# EasyEDA Pro project keyboard.epro

# Schematic sch
Board Name: keyboard; Create Date: 2025-10-21; Page Name: sch-1; Project Name: grabert; Schematic Name: sch; Update Date: 2026-06-16; File: grabert; Id: /; Sheet: /
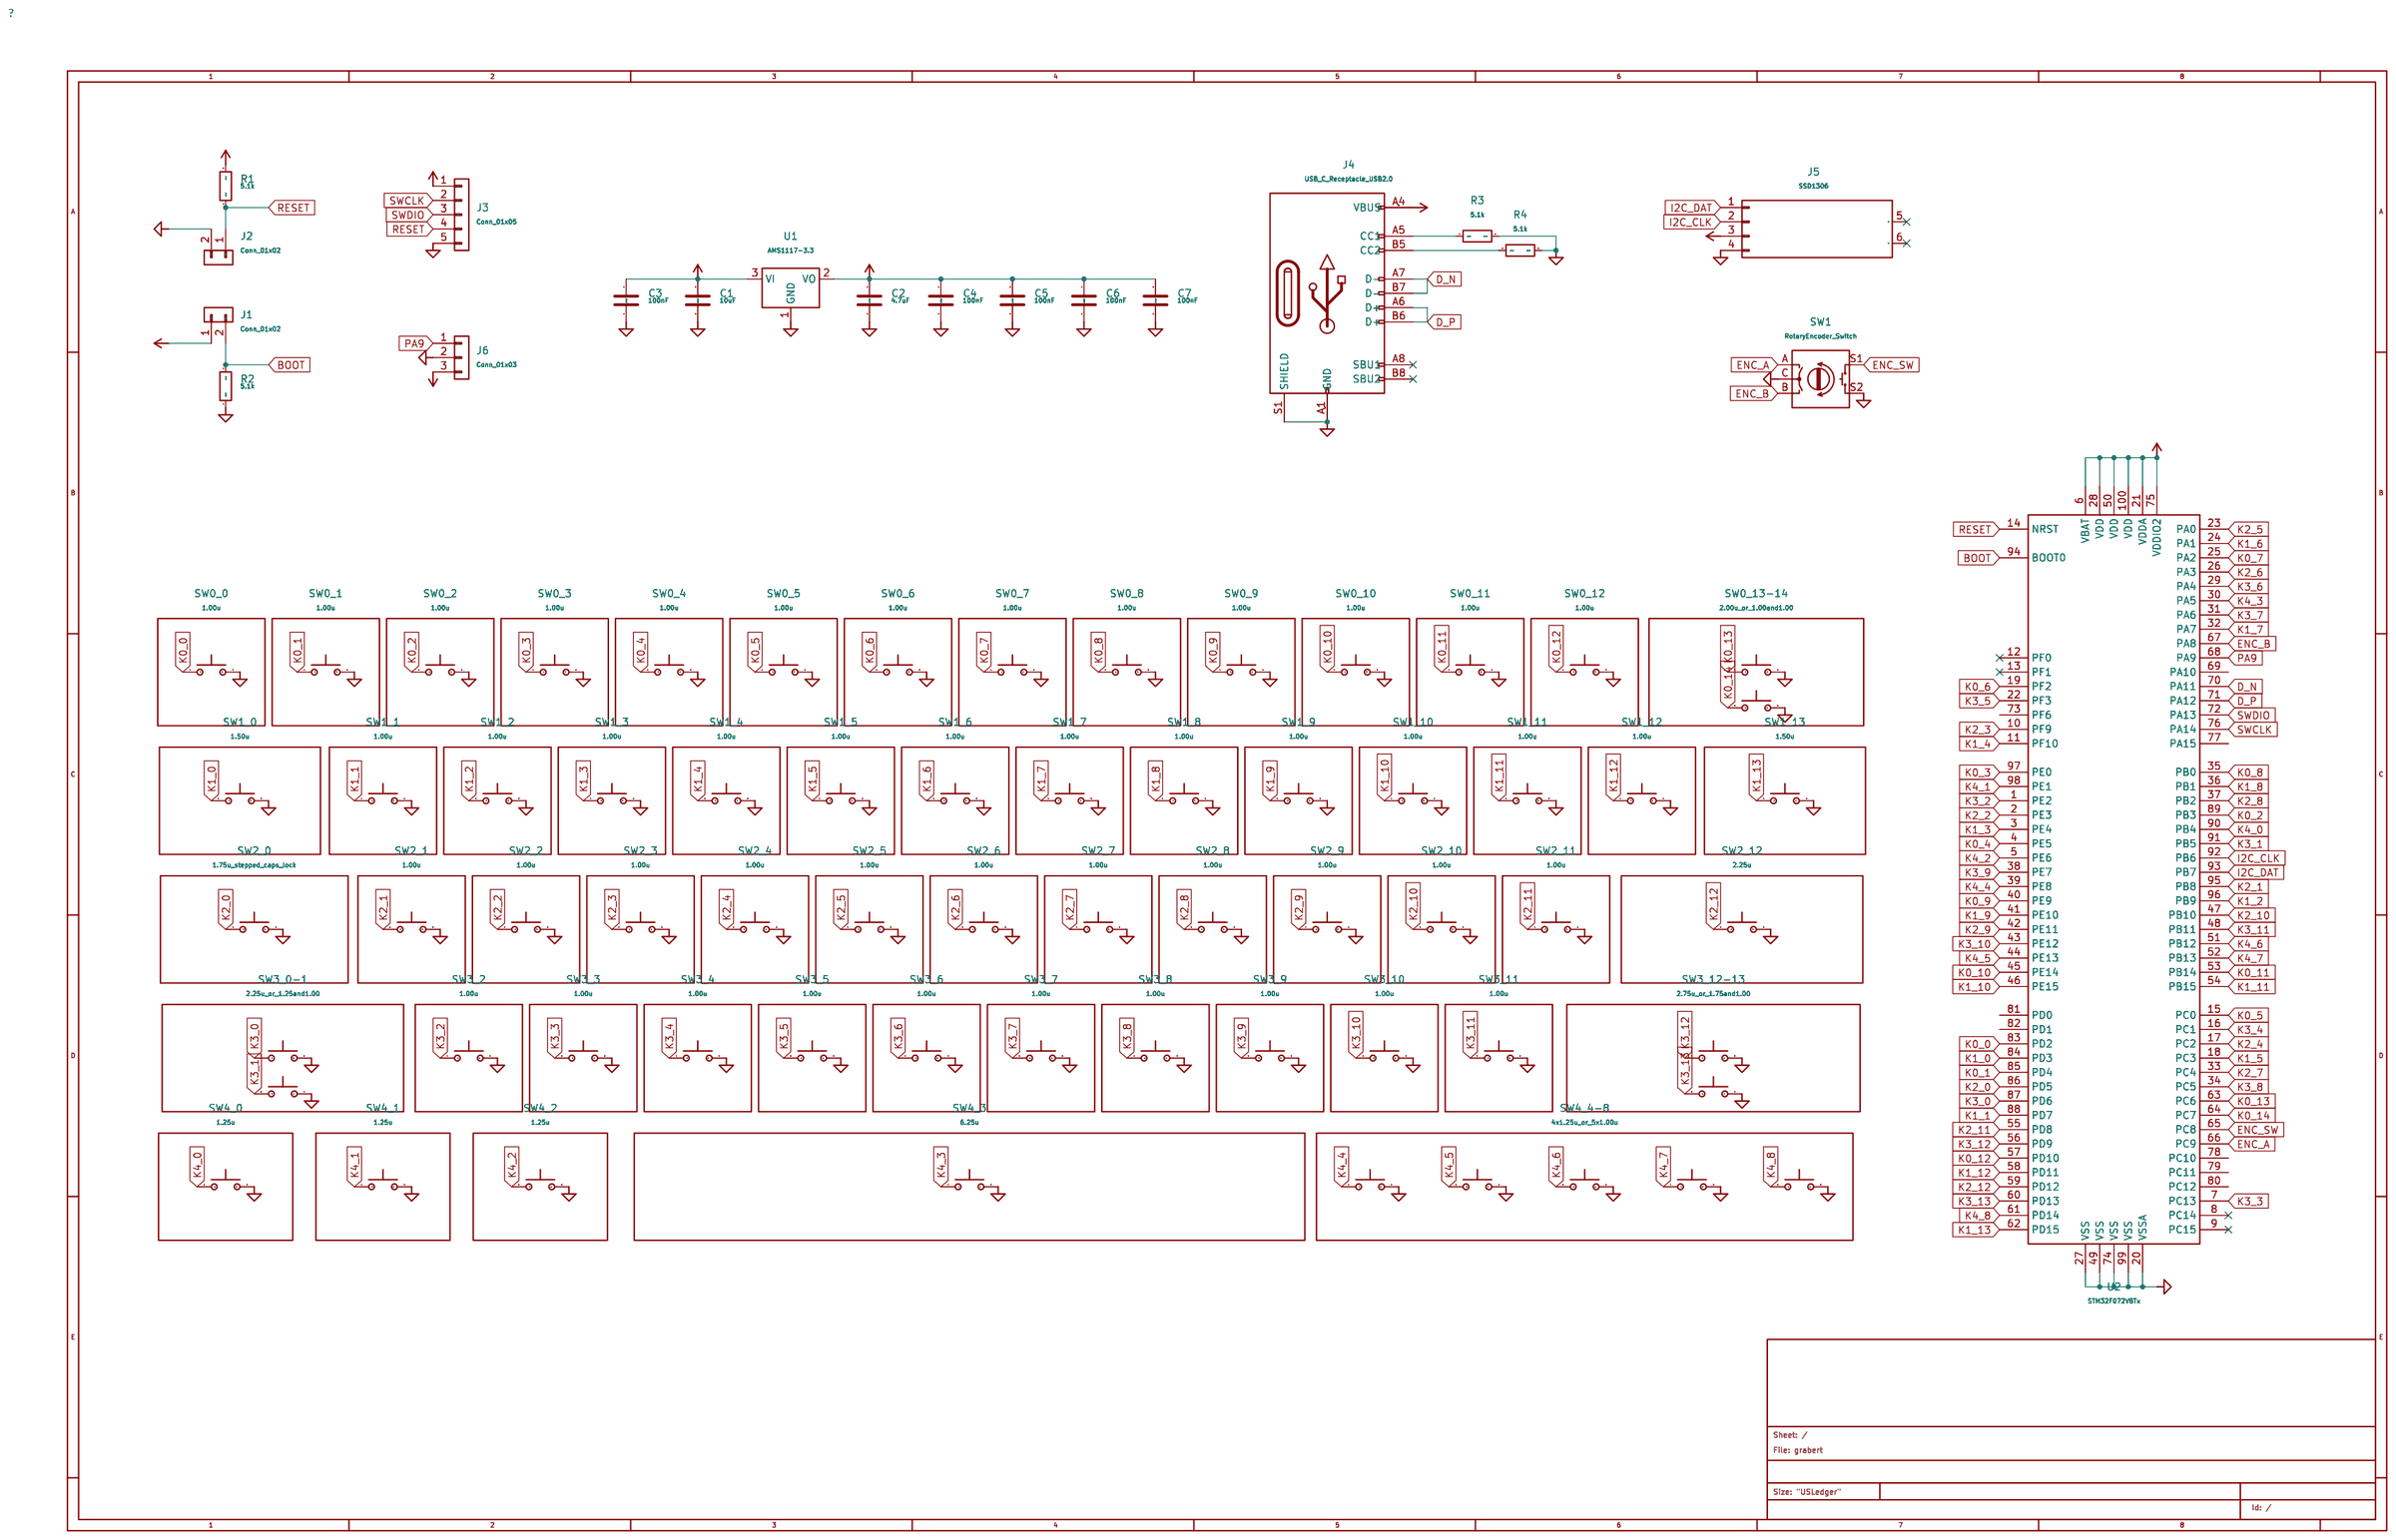
[diagram p0: schematic sheet]

## Parts
C1  10uF
C2  4.7uF
C3  100nF
C4  100nF
C5  100nF
C6  100nF
C7  100nF
J1  Conn_01x02
J2  Conn_01x02
J3  Conn_01x05
J4  USB_C_Receptacle_USB2.0
J5  SSD1306
J6  Conn_01x03
R1  5.1k
R2  5.1k
R3  5.1k
R4  5.1k
SW0_0  1.00u
SW0_1  1.00u
SW0_2  1.00u
SW0_3  1.00u
SW0_4  1.00u
SW0_5  1.00u
SW0_6  1.00u
SW0_7  1.00u
SW0_8  1.00u
SW0_9  1.00u
SW0_10  1.00u
SW0_11  1.00u
SW0_12  1.00u
SW0_13-14  2.00u_or_1.00and1.00
SW1  RotaryEncoder_Switch
SW1_0  1.50u
SW1_1  1.00u
SW1_2  1.00u
SW1_3  1.00u
SW1_4  1.00u
SW1_5  1.00u
SW1_6  1.00u
SW1_7  1.00u
SW1_8  1.00u
SW1_9  1.00u
SW1_10  1.00u
SW1_11  1.00u
SW1_12  1.00u
SW1_13  1.50u
SW2_0  1.75u_stepped_caps_lock
SW2_1  1.00u
SW2_2  1.00u
SW2_3  1.00u
SW2_4  1.00u
SW2_5  1.00u
SW2_6  1.00u
SW2_7  1.00u
SW2_8  1.00u
SW2_9  1.00u
SW2_10  1.00u
SW2_11  1.00u
SW2_12  2.25u
SW3_0-1  2.25u_or_1.25and1.00
SW3_2  1.00u
SW3_3  1.00u
SW3_4  1.00u
SW3_5  1.00u
SW3_6  1.00u
SW3_7  1.00u
SW3_8  1.00u
SW3_9  1.00u
SW3_10  1.00u
SW3_11  1.00u
SW3_12-13  2.75u_or_1.75and1.00
SW4_0  1.25u
SW4_1  1.25u
SW4_2  1.25u
SW4_3  6.25u
SW4_4-8  4x1.25u_or_5x1.00u
U1  AMS1117-3.3
U2  STM32F072V8Tx

## Library data of the parts
C1-C7 = Device_C
J1 J2 = Connector_Generic_Conn_01x02
J3 = Connector_Generic_Conn_01x05
J4 = Connector_USB_C_Receptacle_USB2.0: User doc link: https://www.usb.org/sites/default/files/documents/usb_type-c.zip
J5 = kobuss_SSD1306
J6 = Connector_Generic_Conn_01x03
R1-R4 = Device_R
SW0_0-SW0_12 SW1_1-SW1_12 SW2_1-SW2_11 SW3_2-SW3_11 = kobuss_1.00u
SW0_13-14 = kobuss_2.00u_or_1.00and1.00
SW1 = Device_RotaryEncoder_Switch
SW1_0 SW1_13 = kobuss_1.50u
SW2_0 = kobuss_1.75u_stepped_caps_lock
SW2_12 = kobuss_2.25u
SW3_0-1 = kobuss_2.25u_or_1.25and1.00
SW3_12-13 = kobuss_2.75u_or_1.75and1.00
SW4_0-SW4_2 = kobuss_1.25u
SW4_3 = kobuss_6.25u
SW4_4-8 = kobuss_4x1.25u_or_5x1.00u
U1 = Regulator_Linear_AMS1117-3.3: User doc link: http://www.advanced-monolithic.com/pdf/ds1117.pdf
U2 = MCU_ST_STM32F0_STM32F072V8Tx: User doc link: http://www.st.com/st-web-ui/static/active/en/resource/technical/document/datasheet/DM00090510.pdf

## Nets
BOOT: J1.2(Pin) R2.2 U2.94(BOOT0)
D_N: J4.A7(D-) J4.B7(D-) U2.70(PA11)
D_P: J4.A6(D+) J4.B6(D+) U2.71(PA12)
ENC_A: SW1.A U2.66(PC9)
ENC_B: SW1.B U2.67(PA8)
ENC_SW: SW1.S1 U2.65(PC8)
I2C_CLK: J5.2(SCL) U2.92(PB6)
I2C_DAT: J5.1(SDA) U2.93(PB7)
K0_0: SW0_0.1 U2.83(PD2)
K0_1: SW0_1.1 U2.85(PD4)
K0_2: SW0_2.1 U2.89(PB3)
K0_3: SW0_3.1 U2.97(PE0)
K0_4: SW0_4.1 U2.4(PE5)
K0_5: SW0_5.1 U2.15(PC0)
K0_6: SW0_6.1 U2.19(PF2)
K0_7: SW0_7.1 U2.25(PA2)
K0_8: SW0_8.1 U2.35(PB0)
K0_9: SW0_9.1 U2.40(PE9)
K0_10: SW0_10.1 U2.45(PE14)
K0_11: SW0_11.1 U2.53(PB14)
K0_12: SW0_12.1 U2.57(PD10)
K0_13: SW0_13-14.1 U2.63(PC6)
K0_14: SW0_13-14.3 U2.64(PC7)
K1_0: SW1_0.1 U2.84(PD3)
K1_1: SW1_1.1 U2.88(PD7)
K1_2: SW1_2.1 U2.96(PB9)
K1_3: SW1_3.1 U2.3(PE4)
K1_4: SW1_4.1 U2.11(PF10)
K1_5: SW1_5.1 U2.18(PC3)
K1_6: SW1_6.1 U2.24(PA1)
K1_7: SW1_7.1 U2.32(PA7)
K1_8: SW1_8.1 U2.36(PB1)
K1_9: SW1_9.1 U2.41(PE10)
K1_10: SW1_10.1 U2.46(PE15)
K1_11: SW1_11.1 U2.54(PB15)
K1_12: SW1_12.1 U2.58(PD11)
K1_13: SW1_13.1 U2.62(PD15)
K2_0: SW2_0.1 U2.86(PD5)
K2_1: SW2_1.1 U2.95(PB8)
K2_2: SW2_2.1 U2.2(PE3)
K2_3: SW2_3.1 U2.10(PF9)
K2_4: SW2_4.1 U2.17(PC2)
K2_5: SW2_5.1 U2.23(PA0)
K2_6: SW2_6.1 U2.26(PA3)
K2_7: SW2_7.1 U2.33(PC4)
K2_8: SW2_8.1 U2.37(PB2)
K2_9: SW2_9.1 U2.42(PE11)
K2_10: SW2_10.1 U2.47(PB10)
K2_11: SW2_11.1 U2.55(PD8)
K2_12: SW2_12.1 U2.59(PD12)
K3_0: SW3_0-1.1 U2.87(PD6)
K3_1: SW3_0-1.3 U2.91(PB5)
K3_2: SW3_2.1 U2.1(PE2)
K3_3: SW3_3.1 U2.7(PC13)
K3_4: SW3_4.1 U2.16(PC1)
K3_5: SW3_5.1 U2.22(PF3)
K3_6: SW3_6.1 U2.29(PA4)
K3_7: SW3_7.1 U2.31(PA6)
K3_8: SW3_8.1 U2.34(PC5)
K3_9: SW3_9.1 U2.38(PE7)
K3_10: SW3_10.1 U2.43(PE12)
K3_11: SW3_11.1 U2.48(PB11)
K3_12: SW3_12-13.1 U2.56(PD9)
K3_13: SW3_12-13.3 U2.60(PD13)
K4_0: SW4_0.1 U2.90(PB4)
K4_1: SW4_1.1 U2.98(PE1)
K4_2: SW4_2.1 U2.5(PE6)
K4_3: SW4_3.1 U2.30(PA5)
K4_4: SW4_4-8.1 U2.39(PE8)
K4_5: SW4_4-8.3 U2.44(PE13)
K4_6: SW4_4-8.5 U2.51(PB12)
K4_7: SW4_4-8.7 U2.52(PB13)
K4_8: SW4_4-8.9 U2.61(PD14)
PA9: J6.1(Pin) U2.68(PA9)
POWER_+3V3: C2.1 C4.1 C5.1 C6.1 C7.1 J1.1(Pin) J3.1(Pin) J5.3(VCC) R1.2 U1.2(VO) U2.6(VBAT) U2.21(VDDA) U2.28(VDD) U2.50(VDD) U2.75(VDDIO2) U2.100(VDD)
POWER_+5V: C1.1 C3.1 J4.A4(VBUS) J4.A9(VBUS) J4.B4(VBUS) J4.B9(VBUS) J6.3(Pin) U1.3(VI)
POWER_GND: C1.2 C2.2 C3.2 C4.2 C5.2 C6.2 C7.2 J2.2(Pin) J3.5(Pin) J4.A1(GND) J4.A12(GND) J4.B1(GND) J4.B12(GND) J4.S1(SHIELD) J5.4(GND) J6.2(Pin) R2.1 R3.2 R4.2 SW0_0.2 SW0_1.2 SW0_2.2 SW0_3.2 SW0_4.2 SW0_5.2 SW0_6.2 SW0_7.2 SW0_8.2 SW0_9.2 SW0_10.2 SW0_11.2 SW0_12.2 SW0_13-14.2 SW0_13-14.4 SW1.C SW1.S2 SW1_0.2 SW1_1.2 SW1_2.2 SW1_3.2 SW1_4.2 SW1_5.2 SW1_6.2 SW1_7.2 SW1_8.2 SW1_9.2 SW1_10.2 SW1_11.2 SW1_12.2 SW1_13.2 SW2_0.2 SW2_1.2 SW2_2.2 SW2_3.2 SW2_4.2 SW2_5.2 SW2_6.2 SW2_7.2 SW2_8.2 SW2_9.2 SW2_10.2 SW2_11.2 SW2_12.2 SW3_0-1.2 SW3_0-1.4 SW3_2.2 SW3_3.2 SW3_4.2 SW3_5.2 SW3_6.2 SW3_7.2 SW3_8.2 SW3_9.2 SW3_10.2 SW3_11.2 SW3_12-13.2 SW3_12-13.4 SW4_0.2 SW4_1.2 SW4_2.2 SW4_3.2 SW4_4-8.2 SW4_4-8.4 SW4_4-8.6 SW4_4-8.8 SW4_4-8.10 U1.1(GND) U2.20(VSSA) U2.27(VSS) U2.49(VSS) U2.74(VSS) U2.99(VSS)
RESET: J2.1(Pin) J3.4(Pin) R1.1 U2.14(NRST)
SWCLK: J3.2(Pin) U2.76(PA14)
SWDIO: J3.3(Pin) U2.72(PA13)
Net-(J4-A5): J4.A5(CC1) R3.1
Net-(J4-B5): J4.B5(CC2) R4.1

Not connected (* = marked no-connect by the designer): J4 A8(SBU1)* B8(SBU2)*; J5 5(MNT)* 6(MNT)*; U2 8(PC14)* 9(PC15)* 12(PF0)* 13(PF1)* 69(PA10) 73(PF6) 77(PA15) 78(PC10) 79(PC11) 80(PC12) 81(PD0) 82(PD1)

# Board pcb
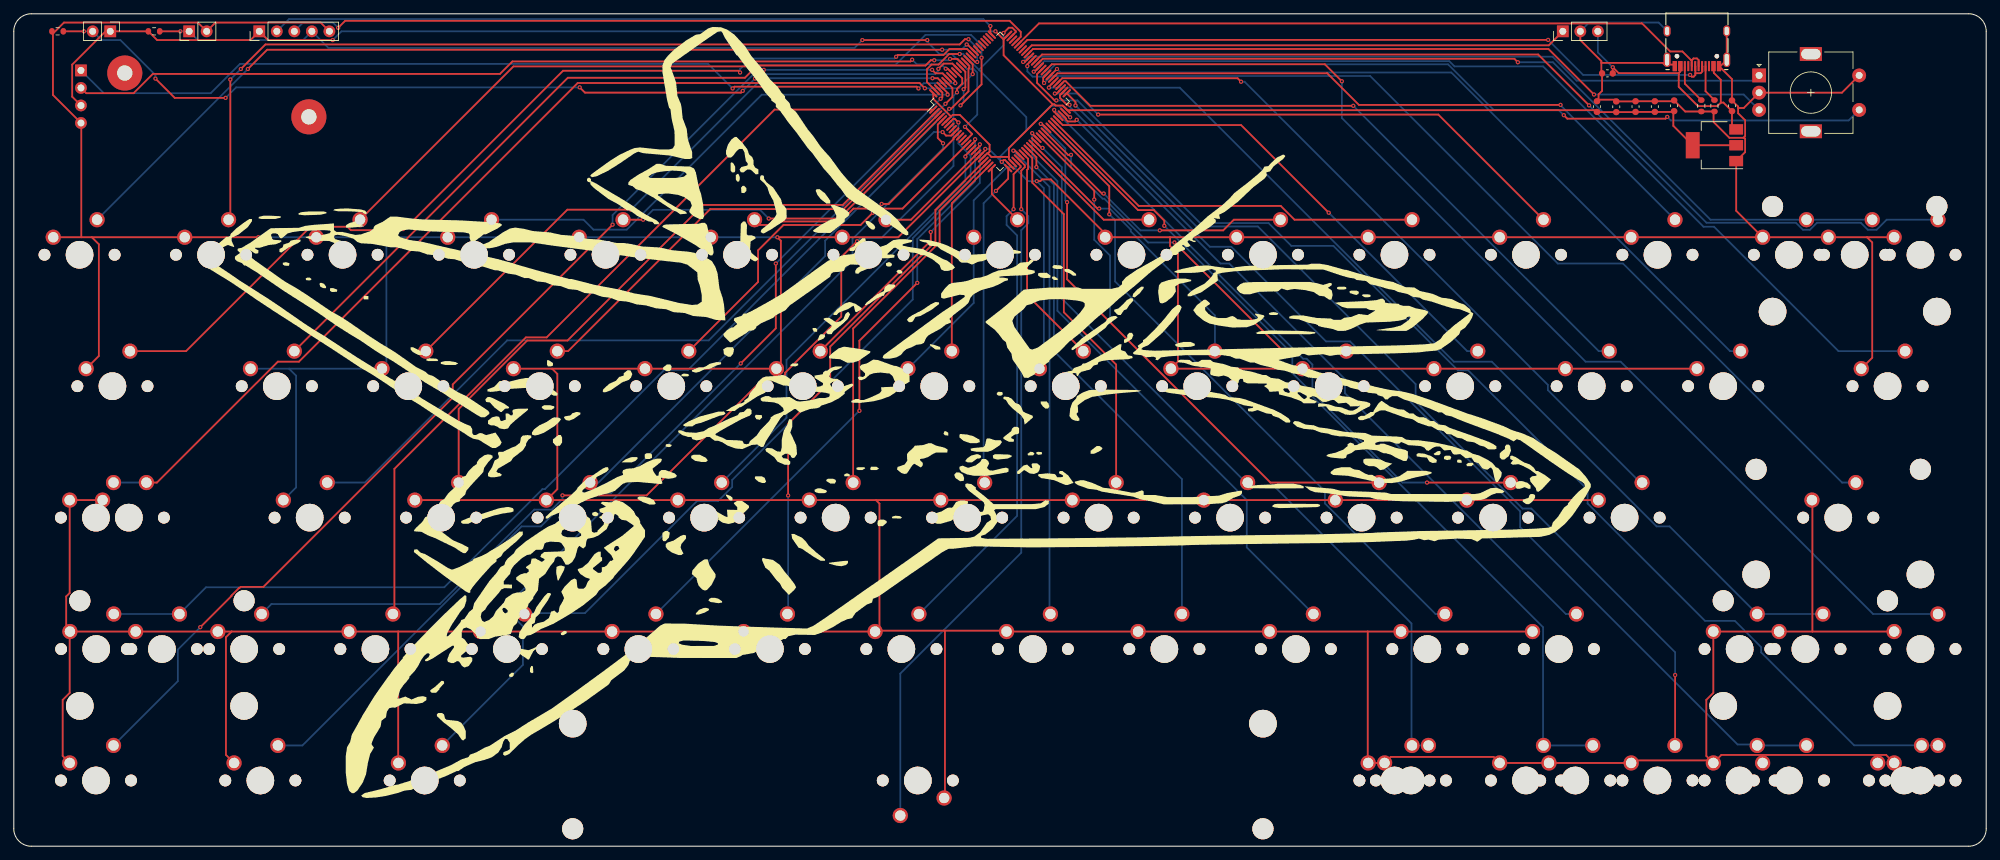
[diagram p1: board, top side]
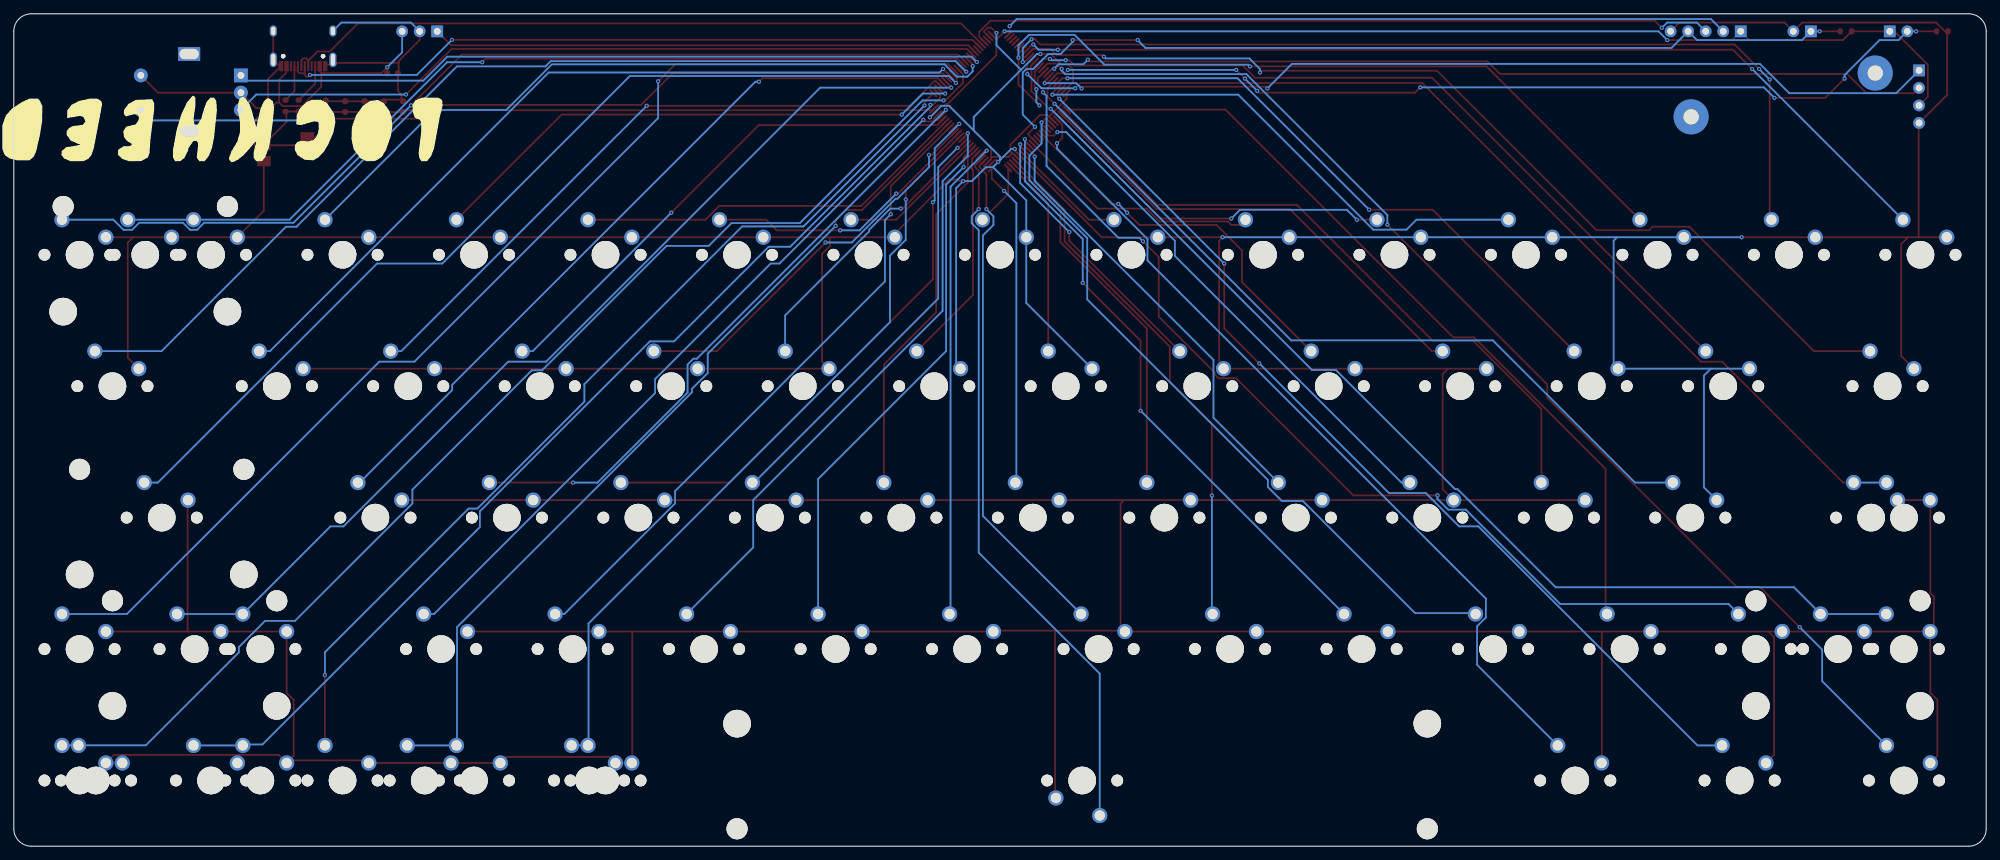
[diagram p2: board, bottom side, seen from below]

Outline 285.75 x 120.65 mm; copper layers: Top Layer, Bottom Layer. Coordinates in mm from the lower left corner of the outline.
Outline path: 0,118.11 0,2.54 arc(0.74,0.74) 2.54,0 283.21,0 arc(285.01,0.74) 285.75,2.54 285.75,118.11 arc(285.01,119.91) 283.21,120.65 2.54,120.65 arc(0.74,119.91) 0,118.11
Stack: Top Layer 0.0009mm / dielectric 1 0.0384mm FR4 er 4.5 / Bottom Layer 0.0009mm

## Design rules (mm)
spacing safeClearance (default): track to track 0.152, other pairs 0.152 to 0.3
track width trackWidth (default): min 0.127, default 0.254, max 2.54
differential pair differentialPair (default): width min 0.127, default 0.254, max 2.54; gap min 0.152, default 0.152
via viaSize (default): diameter min 0.5, default 0.61, max 10; hole min 0.3, default 0.305, max 6
net GND uses CopperRegion1

## Placement (name value [footprint] x y rotation side)
C1  10uF  [Capacitor_SMD:C_0603_1608Metric]  248.92 107.31 90 top
C2  4.7uF  [Capacitor_SMD:C_0603_1608Metric]  240.54 107.31 90 top
C3  100nF  [Capacitor_SMD:C_0603_1608Metric]  230.87 112.01 180 top
C4  100nF  [Capacitor_SMD:C_0603_1608Metric]  229.36 107.2 90 top
C5  100nF  [Capacitor_SMD:C_0603_1608Metric]  237.74 107.2 90 top
C6  100nF  [Capacitor_SMD:C_0603_1608Metric]  234.95 107.2 90 top
C7  100nF  [Capacitor_SMD:C_0603_1608Metric]  232.16 107.17 90 top
J1  Conn_01x02  [Connector_PinHeader_2.54mm:PinHeader_1x02_P2.54mm_Vertical]  13.97 118.11 270 top
J2  Conn_01x02  [Connector_PinHeader_2.54mm:PinHeader_1x02_P2.54mm_Vertical]  25.4 118.11 90 top
J3  Conn_01x05  [Connector_PinHeader_2.54mm:PinHeader_1x05_P2.54mm_Vertical]  35.56 118.11 90 top
J4  USB_C_Receptacle_USB2.0  [kobuss-footprint:U262-161N-4BVC11]  243.84 113.06 180 top
J5  SSD1306  [kobuss-footprint:SSD1306]  8.46 114.6 0 top
J6  Conn_01x03  [Connector_PinHeader_2.54mm:PinHeader_1x03_P2.54mm_Vertical]  224.41 118.11 90 top
R1  5.1k  [Resistor_SMD:R_0603_1608Metric]  20.32 118.11 180 top
R2  5.1k  [Resistor_SMD:R_0603_1608Metric]  6.35 118.11 0 top
R3  5.1k  [Resistor_SMD:R_0603_1608Metric]  246.38 107.31 270 top
R4  5.1k  [Resistor_SMD:R_0603_1608Metric]  244.47 107.31 270 top
SW0_0  1.00u  [kobuss-footprint:MX_1u]  9.52 85.72 0 top
SW0_1  1.00u  [kobuss-footprint:MX_1u]  28.58 85.72 0 top
SW0_2  1.00u  [kobuss-footprint:MX_1u]  47.62 85.72 0 top
SW0_3  1.00u  [kobuss-footprint:MX_1u]  66.67 85.72 0 top
SW0_4  1.00u  [kobuss-footprint:MX_1u]  85.72 85.72 0 top
SW0_5  1.00u  [kobuss-footprint:MX_1u]  104.78 85.72 0 top
SW0_6  1.00u  [kobuss-footprint:MX_1u]  123.82 85.72 0 top
SW0_7  1.00u  [kobuss-footprint:MX_1u]  142.88 85.72 0 top
SW0_8  1.00u  [kobuss-footprint:MX_1u]  161.93 85.72 0 top
SW0_9  1.00u  [kobuss-footprint:MX_1u]  180.97 85.72 0 top
SW0_10  1.00u  [kobuss-footprint:MX_1u]  200.03 85.72 0 top
SW0_11  1.00u  [kobuss-footprint:MX_1u]  219.07 85.72 0 top
SW0_12  1.00u  [kobuss-footprint:MX_1u]  238.12 85.72 0 top
SW0_13-14  2.00u_or_1.00and1.00  [kobuss-footprint:MX_2.00u_or_1.00and1.00]  266.7 85.72 0 top
SW1  RotaryEncoder_Switch  [kobuss-footprint:PEC11R-4220K-S0024]  252.85 111.72 0 top
SW1_0  1.50u  [kobuss-footprint:MX_1.50u]  14.29 66.67 0 top
SW1_1  1.00u  [kobuss-footprint:MX_1u]  38.1 66.67 0 top
SW1_2  1.00u  [kobuss-footprint:MX_1u]  57.15 66.67 0 top
SW1_3  1.00u  [kobuss-footprint:MX_1u]  76.2 66.67 0 top
SW1_4  1.00u  [kobuss-footprint:MX_1u]  95.25 66.67 0 top
SW1_5  1.00u  [kobuss-footprint:MX_1u]  114.3 66.67 0 top
SW1_6  1.00u  [kobuss-footprint:MX_1u]  133.35 66.67 0 top
SW1_7  1.00u  [kobuss-footprint:MX_1u]  152.4 66.67 0 top
SW1_8  1.00u  [kobuss-footprint:MX_1u]  171.45 66.67 0 top
SW1_9  1.00u  [kobuss-footprint:MX_1u]  190.5 66.67 0 top
SW1_10  1.00u  [kobuss-footprint:MX_1u]  209.55 66.67 0 top
SW1_11  1.00u  [kobuss-footprint:MX_1u]  228.6 66.67 0 top
SW1_12  1.00u  [kobuss-footprint:MX_1u]  247.65 66.67 0 top
SW1_13  1.50u  [kobuss-footprint:MX_1.50u]  271.46 66.67 0 top
SW2_0  1.75u_stepped_caps_lock  [kobuss-footprint:MX_1.75u_stepped_caps]  16.67 47.62 0 top
SW2_1  1.00u  [kobuss-footprint:MX_1u]  42.86 47.62 0 top
SW2_2  1.00u  [kobuss-footprint:MX_1u]  61.91 47.62 0 top
SW2_3  1.00u  [kobuss-footprint:MX_1u]  80.96 47.62 0 top
SW2_4  1.00u  [kobuss-footprint:MX_1u]  100.01 47.62 0 top
SW2_5  1.00u  [kobuss-footprint:MX_1u]  119.06 47.62 0 top
SW2_6  1.00u  [kobuss-footprint:MX_1u]  138.11 47.62 0 top
SW2_7  1.00u  [kobuss-footprint:MX_1u]  157.16 47.62 0 top
SW2_8  1.00u  [kobuss-footprint:MX_1u]  176.21 47.62 0 top
SW2_9  1.00u  [kobuss-footprint:MX_1u]  195.26 47.62 0 top
SW2_10  1.00u  [kobuss-footprint:MX_1u]  214.31 47.62 0 top
SW2_11  1.00u  [kobuss-footprint:MX_1u]  233.36 47.62 0 top
SW2_12  2.25u  [kobuss-footprint:MX_2.25u]  264.32 47.62 0 top
SW3_0-1  2.25u_or_1.25and1.00  [kobuss-footprint:MX_2.25u_or_1.25and1.00]  21.46 28.57 0 top
SW3_2  1.00u  [kobuss-footprint:MX_1u]  52.39 28.57 0 top
SW3_3  1.00u  [kobuss-footprint:MX_1u]  71.44 28.57 0 top
SW3_4  1.00u  [kobuss-footprint:MX_1u]  90.49 28.57 0 top
SW3_5  1.00u  [kobuss-footprint:MX_1u]  109.54 28.57 0 top
SW3_6  1.00u  [kobuss-footprint:MX_1u]  128.59 28.57 0 top
SW3_7  1.00u  [kobuss-footprint:MX_1u]  147.64 28.57 0 top
SW3_8  1.00u  [kobuss-footprint:MX_1u]  166.69 28.57 0 top
SW3_9  1.00u  [kobuss-footprint:MX_1u]  185.74 28.57 0 top
SW3_10  1.00u  [kobuss-footprint:MX_1u]  204.79 28.57 0 top
SW3_11  1.00u  [kobuss-footprint:MX_1u]  223.84 28.57 0 top
SW3_12-13  2.75u_or_1.75and1.00  [kobuss-footprint:MX_2.75u_or_1.75and1.00]  259.56 28.57 0 top
SW4_0  1.25u  [kobuss-footprint:MX_1.25]  11.91 9.53 0 top
SW4_1  1.25u  [kobuss-footprint:MX_1.25]  35.72 9.53 0 top
SW4_2  1.25u  [kobuss-footprint:MX_1.25]  59.53 9.53 0 top
SW4_3  6.25u  [kobuss-footprint:MX_6.25u]  130.97 9.53 180 top
SW4_4-8  4x1.25u_or_5x1.00u  [kobuss-footprint:MX_4x1.25u_or_5x1.00u]  238.12 9.53 0 top
U1  AMS1117-3.3  [Package_TO_SOT_SMD:SOT-223-3_TabPin2]  246.38 101.6 180 top
U2  STM32F072V8Tx  [Package_QFP:LQFP-100_14x14mm_P0.5mm]  142.88 107.95 45 top

## Footprints (pads in the part's own frame, mm; a bottom-side part is the same pattern mirrored in y, then rotated)
Capacitor_SMD:C_0603_1608Metric
  rrect 0.9x0.95 smd: 1(-0.775,0) 2(0.775,0)
Connector_PinHeader_2.54mm:PinHeader_1x02_P2.54mm_Vertical
  rect 1.7x1.7 hole 1: 1(0,0)
  round 1.7 hole 1: 2(0,-2.54)
Connector_PinHeader_2.54mm:PinHeader_1x03_P2.54mm_Vertical
  rect 1.7x1.7 hole 1: 1(0,0)
  round 1.7 hole 1: 2(0,-2.54) 3(0,-5.08)
Connector_PinHeader_2.54mm:PinHeader_1x05_P2.54mm_Vertical
  rect 1.7x1.7 hole 1: 1(0,0)
  round 1.7 hole 1: 2(0,-2.54) 3(0,-5.08) 4(0,-7.62) 5(0,-10.16)
kobuss-footprint:MX_1.25
  round 1.7 hole 1.7: (-5.08,0) (5.08,0)
  round 4 hole 4: (0,0)
  round 2.2 hole 1.5: 1(2.54,5.08) 2(-3.81,2.54)
kobuss-footprint:MX_1.50u
  round 1.7 hole 1.7: (-5.08,0) (5.08,0)
  round 4 hole 4: (0,0)
  round 2.2 hole 1.5: 1(2.54,5.08) 2(-3.81,2.54)
kobuss-footprint:MX_1.75u_stepped_caps
  round 1.7 hole 1.7: (-9.842,0) (-5.08,0) (0.318,0) (5.08,0)
  round 4 hole 4: (-4.763,0) (0,0)
  round 2.2 hole 1.5: 1(-2.223,5.08) 1(2.54,5.08) 2(-8.572,2.54) 2(-3.81,2.54)
kobuss-footprint:MX_1u
  round 1.7 hole 1.7: (-5.08,0) (5.08,0)
  round 4 hole 4: (0,0)
  round 2.2 hole 1.5: 1(2.54,5.08) 2(-3.81,2.54)
kobuss-footprint:MX_2.00u_or_1.00and1.00
  round 1.7 hole 1.7: (-14.605,0) (-5.08,0) (-4.445,0) (4.445,0) (5.08,0) (14.605,0)
  round 3.05 hole 3.05: (-11.9,7) (11.9,7)
  round 4 hole 4: (-11.9,-8.24) (-9.525,0) (0,0) (9.525,0) (11.9,-8.24)
  round 2.2 hole 1.5: 1(-6.985,5.08) 1(2.54,5.08) 2(-13.335,2.54) 2(-3.81,2.54) 3(12.065,5.08) 4(5.715,2.54)
kobuss-footprint:MX_2.25u
  round 3.05 hole 3.05: (-11.9,7) (11.9,7)
  round 4 hole 4: (-11.9,-8.24) (0,0) (11.9,-8.24)
  round 1.7 hole 1.7: (-5.08,0) (5.08,0)
  round 2.2 hole 1.5: 1(2.54,5.08) 2(-3.81,2.54)
kobuss-footprint:MX_2.25u_or_1.25and1.00
  round 1.7 hole 1.7: (-14.605,0) (-5.08,0) (-4.445,0) (5.08,0) (6.827,0) (16.986,0)
  round 3.05 hole 3.05: (-11.9,7) (11.9,7)
  round 4 hole 4: (-11.9,-8.24) (-9.525,0) (0,0) (11.9,-8.24) (11.906,0)
  round 2.2 hole 1.5: 1(-6.985,5.08) 1(2.54,5.08) 2(-13.335,2.54) 2(-3.81,2.54) 3(14.447,5.08) 4(8.097,2.54)
kobuss-footprint:MX_2.75u_or_1.75and1.00
  round 1.7 hole 1.7: (-14.605,0) (-5.08,0) (-4.445,0) (5.08,0) (11.588,0) (21.747,0)
  round 3.05 hole 3.05: (-11.9,7) (11.9,7)
  round 4 hole 4: (-11.9,-8.24) (-9.525,0) (0,0) (11.9,-8.24) (16.668,0)
  round 2.2 hole 1.5: 1(-6.985,5.08) 1(2.54,5.08) 2(-13.335,2.54) 2(-3.81,2.54) 3(19.207,5.08) 4(12.857,2.54)
kobuss-footprint:MX_4x1.25u_or_5x1.00u
  round 1.7 hole 1.7: (-43.18,0) (-40.799,0) (-33.02,0) (-30.639,0) (-24.13,0) (-16.986,0) (-13.97,0) (-6.827,0) (-5.08,0) (5.08,0) (6.827,0) (13.97,0) (16.986,0) (24.13,0) (30.639,0) (33.02,0) (40.799,0) (43.18,0)
  round 4 hole 4: (-38.1,0) (-35.719,0) (-19.05,0) (-11.906,0) (0,0) (11.906,0) (19.05,0) (35.719,0) (38.1,0)
  round 2.2 hole 1.5: 1(-35.56,5.08) 1(-33.179,5.08) 2(-41.91,2.54) 2(-39.529,2.54) 3(-16.51,5.08) 3(-9.367,5.08) 4(-22.86,2.54) 4(-15.716,2.54) 5(2.54,5.08) 6(-3.81,2.54) 7(14.447,5.08) 7(21.59,5.08) 8(8.097,2.54) 8(15.24,2.54) 9(38.259,5.08) 9(40.64,5.08) 10(31.909,2.54) 10(34.29,2.54)
kobuss-footprint:MX_6.25u
  round 3.05 hole 3.05: (-50,7) (50,7)
  round 4 hole 4: (-50,-8.24) (0,0) (50,-8.24)
  round 1.7 hole 1.7: (-5.08,0) (5.08,0)
  round 2.2 hole 1.5: 1(2.54,5.08) 2(-3.81,2.54)
kobuss-footprint:PEC11R-4220K-S0024
  rect 2x2 hole 1: A(0,0)
  round 2 hole 1: B(0,-5) C(0,-2.5) S1(14.5,-5) S2(14.5,0)
  rect 3.2x2 hole 2.8x1.5: MP(7.5,3.1) MP(7.5,-8.1)
kobuss-footprint:SSD1306
  rect 1.7x1.7 hole 1: 1(1.27,-2.159)
  round 1.7 hole 1: 2(1.27,-4.699) 3(1.27,-7.239) 4(1.27,-9.779)
  round 5.08 hole 2.21: 5(7.62,-2.54) 6(34.29,-8.89)
kobuss-footprint:U262-161N-4BVC11
  round 0.65 hole 0.65: (-2.89,-1.445) (2.89,-1.445)
  rect 0.6x1.45 smd: A1(-3.2,0) A4(-2.4,0) A9(-2.4,0) A12(-3.2,0) B1(3.2,0) B4(2.4,0) B9(2.4,0) B12(3.2,0)
  rect 0.3x1.45 smd: A5(-1.25,0) A6(-0.25,0) A7(0.25,0) A8(1.25,0) B5(1.75,0) B6(0.75,0) B7(-0.75,0) B8(-1.75,0)
  oval 1x2.1 hole 0.6x1.7: S1(-4.32,-0.915) S1(4.32,-0.915)
  oval 1x1.6 hole 0.6x1.2: S1(-4.32,-5.095) S1(4.32,-5.095)
Package_QFP:LQFP-100_14x14mm_P0.5mm
  rrect 1.6x0.3 smd: 1(-7.675,6) 2(-7.675,5.5) 3(-7.675,5) 4(-7.675,4.5) 5(-7.675,4) 6(-7.675,3.5) 7(-7.675,3) 8(-7.675,2.5) 9(-7.675,2) 10(-7.675,1.5) 11(-7.675,1) 12(-7.675,0.5) 13(-7.675,0) 14(-7.675,-0.5) 15(-7.675,-1) 16(-7.675,-1.5) 17(-7.675,-2) 18(-7.675,-2.5) 19(-7.675,-3) 20(-7.675,-3.5) 21(-7.675,-4) 22(-7.675,-4.5) 23(-7.675,-5) 24(-7.675,-5.5) 25(-7.675,-6) 51(7.675,-6) 52(7.675,-5.5) 53(7.675,-5) 54(7.675,-4.5) 55(7.675,-4) 56(7.675,-3.5) 57(7.675,-3) 58(7.675,-2.5) 59(7.675,-2) 60(7.675,-1.5) 61(7.675,-1) 62(7.675,-0.5) 63(7.675,0) 64(7.675,0.5) 65(7.675,1) 66(7.675,1.5) 67(7.675,2) 68(7.675,2.5) 69(7.675,3) 70(7.675,3.5) 71(7.675,4) 72(7.675,4.5) 73(7.675,5) 74(7.675,5.5) 75(7.675,6)
  rrect 0.3x1.6 smd: 26(-6,-7.675) 27(-5.5,-7.675) 28(-5,-7.675) 29(-4.5,-7.675) 30(-4,-7.675) 31(-3.5,-7.675) 32(-3,-7.675) 33(-2.5,-7.675) 34(-2,-7.675) 35(-1.5,-7.675) 36(-1,-7.675) 37(-0.5,-7.675) 38(0,-7.675) 39(0.5,-7.675) 40(1,-7.675) 41(1.5,-7.675) 42(2,-7.675) 43(2.5,-7.675) 44(3,-7.675) 45(3.5,-7.675) 46(4,-7.675) 47(4.5,-7.675) 48(5,-7.675) 49(5.5,-7.675) 50(6,-7.675) 76(6,7.675) 77(5.5,7.675) 78(5,7.675) 79(4.5,7.675) 80(4,7.675) 81(3.5,7.675) 82(3,7.675) 83(2.5,7.675) 84(2,7.675) 85(1.5,7.675) 86(1,7.675) 87(0.5,7.675) 88(0,7.675) 89(-0.5,7.675) 90(-1,7.675) 91(-1.5,7.675) 92(-2,7.675) 93(-2.5,7.675) 94(-3,7.675) 95(-3.5,7.675) 96(-4,7.675) 97(-4.5,7.675) 98(-5,7.675) 99(-5.5,7.675) 100(-6,7.675)
Package_TO_SOT_SMD:SOT-223-3_TabPin2
  rect 2x1.5 smd: 1(-3.15,2.3) 2(-3.15,0) 3(-3.15,-2.3)
  rect 2x3.8 smd: 2(3.15,0)
Resistor_SMD:R_0603_1608Metric
  rrect 0.8x0.95 smd: 1(-0.825,0) 2(0.825,0)

## Nets
+3V3: C2.1 C4.1 C5.1 C6.1 C7.1 J1.1 J3.1 J5.3 R1.2 U1.2 U2.6 U2.21 U2.28 U2.50 U2.75 U2.100
+5V: C1.1 C3.1 J4.A4 J4.A9 J4.B4 J4.B9 J6.3 U1.3
GND: C1.2 C2.2 C3.2 C4.2 C5.2 C6.2 C7.2 J2.2 J3.5 J4.A1 J4.A12 J4.B1 J4.B12 J4.S1 J5.4 J6.2 R2.1 R3.2 R4.2 SW0_0.2 SW0_1.2 SW0_2.2 SW0_3.2 SW0_4.2 SW0_5.2 SW0_6.2 SW0_7.2 SW0_8.2 SW0_9.2 SW0_10.2 SW0_11.2 SW0_12.2 SW0_13-14.2 SW0_13-14.4 SW1.C SW1.S2 SW1_0.2 SW1_1.2 SW1_2.2 SW1_3.2 SW1_4.2 SW1_5.2 SW1_6.2 SW1_7.2 SW1_8.2 SW1_9.2 SW1_10.2 SW1_11.2 SW1_12.2 SW1_13.2 SW2_0.2 SW2_1.2 SW2_2.2 SW2_3.2 SW2_4.2 SW2_5.2 SW2_6.2 SW2_7.2 SW2_8.2 SW2_9.2 SW2_10.2 SW2_11.2 SW2_12.2 SW3_0-1.2 SW3_0-1.4 SW3_2.2 SW3_3.2 SW3_4.2 SW3_5.2 SW3_6.2 SW3_7.2 SW3_8.2 SW3_9.2 SW3_10.2 SW3_11.2 SW3_12-13.2 SW3_12-13.4 SW4_0.2 SW4_1.2 SW4_2.2 SW4_3.2 SW4_4-8.2 SW4_4-8.4 SW4_4-8.6 SW4_4-8.8 SW4_4-8.10 U1.1 U2.20 U2.27 U2.49 U2.74 U2.99
BOOT: J1.2 R2.2 U2.94
D_N: J4.A7 J4.B7 U2.70
D_P: J4.A6 J4.B6 U2.71
ENC_A: SW1.A U2.66
ENC_B: SW1.B U2.67
ENC_SW: SW1.S1 U2.65
I2C_CLK: J5.2 U2.92
I2C_DAT: J5.1 U2.93
K0_0: SW0_0.1 U2.83
K0_1: SW0_1.1 U2.85
K0_2: SW0_2.1 U2.89
K0_3: SW0_3.1 U2.97
K0_4: SW0_4.1 U2.4
K0_5: SW0_5.1 U2.15
K0_6: SW0_6.1 U2.19
K0_7: SW0_7.1 U2.25
K0_8: SW0_8.1 U2.35
K0_9: SW0_9.1 U2.40
K0_10: SW0_10.1 U2.45
K0_11: SW0_11.1 U2.53
K0_12: SW0_12.1 U2.57
K0_13: SW0_13-14.1 U2.63
K0_14: SW0_13-14.3 U2.64
K1_0: SW1_0.1 U2.84
K1_1: SW1_1.1 U2.88
K1_2: SW1_2.1 U2.96
K1_3: SW1_3.1 U2.3
K1_4: SW1_4.1 U2.11
K1_5: SW1_5.1 U2.18
K1_6: SW1_6.1 U2.24
K1_7: SW1_7.1 U2.32
K1_8: SW1_8.1 U2.36
K1_9: SW1_9.1 U2.41
K1_10: SW1_10.1 U2.46
K1_11: SW1_11.1 U2.54
K1_12: SW1_12.1 U2.58
K1_13: SW1_13.1 U2.62
K2_0: SW2_0.1 U2.86
K2_1: SW2_1.1 U2.95
K2_2: SW2_2.1 U2.2
K2_3: SW2_3.1 U2.10
K2_4: SW2_4.1 U2.17
K2_5: SW2_5.1 U2.23
K2_6: SW2_6.1 U2.26
K2_7: SW2_7.1 U2.33
K2_8: SW2_8.1 U2.37
K2_9: SW2_9.1 U2.42
K2_10: SW2_10.1 U2.47
K2_11: SW2_11.1 U2.55
K2_12: SW2_12.1 U2.59
K3_0: SW3_0-1.1 U2.87
K3_1: SW3_0-1.3 U2.91
K3_2: SW3_2.1 U2.1
K3_3: SW3_3.1 U2.7
K3_4: SW3_4.1 U2.16
K3_5: SW3_5.1 U2.22
K3_6: SW3_6.1 U2.29
K3_7: SW3_7.1 U2.31
K3_8: SW3_8.1 U2.34
K3_9: SW3_9.1 U2.38
K3_10: SW3_10.1 U2.43
K3_11: SW3_11.1 U2.48
K3_12: SW3_12-13.1 U2.56
K3_13: SW3_12-13.3 U2.60
K4_0: SW4_0.1 U2.90
K4_1: SW4_1.1 U2.98
K4_2: SW4_2.1 U2.5
K4_3: SW4_3.1 U2.30
K4_4: SW4_4-8.1 U2.39
K4_5: SW4_4-8.3 U2.44
K4_6: SW4_4-8.5 U2.51
K4_7: SW4_4-8.7 U2.52
K4_8: SW4_4-8.9 U2.61
NET-(J4-PADA5): J4.A5 R3.1
NET-(J4-PADB5): J4.B5 R4.1
PA9: J6.1 U2.68
RESET: J2.1 J3.4 R1.1 U2.14
SWCLK: J3.2 U2.76
SWDIO: J3.3 U2.72
UNCONNECTED-(J4-PADA8): J4.A8
UNCONNECTED-(J4-PADB8): J4.B8
UNCONNECTED-(J5-PAD5): J5.5
UNCONNECTED-(J5-PAD6): J5.6
UNCONNECTED-(U2-PAD8): U2.8
UNCONNECTED-(U2-PAD9): U2.9
UNCONNECTED-(U2-PAD12): U2.12
UNCONNECTED-(U2-PAD13): U2.13
UNCONNECTED-(U2-PAD69): U2.69
UNCONNECTED-(U2-PAD73): U2.73
UNCONNECTED-(U2-PAD77): U2.77
UNCONNECTED-(U2-PAD78): U2.78
UNCONNECTED-(U2-PAD79): U2.79
UNCONNECTED-(U2-PAD80): U2.80
UNCONNECTED-(U2-PAD81): U2.81
UNCONNECTED-(U2-PAD82): U2.82

Pads without a net: SW1 MP

## Via types
v1: diameter 0.61, hole 0.305, Top Layer to Bottom Layer, 119 vias

## Routing (per net, layer and track width the routed paths; a pad name or vN(x,y) marks a point on that pad's centre or on a via; arc(x,y) is an arc through that point)
+3V3: length 292.4
  Top Layer w0.254: 135.78,105.75 135.03,105 134.97,105 ; 135.78,105.75 133.21,108.33 U2.100 ; 135.78,105.75 136.03,106 137.05,106 141.37,101.69 141.37,100.67 141.11,100.42 ; 150.51,107.53 143.4,114.64 143.4,116.93 ; 150.51,107.53 144.16,101.18 144.16,99.91 ; 150.51,107.53 150.77,107.53 150.94,107.35 151.96,107.35 U2.50 152.63,106.68 229.11,106.68 C4.1 229.39,106.4 C7.1 234.92,106.4 C6.1 C5.1 240.42,106.43 ; U2.21 141,100.42 141.11,100.42 ; 240.42,106.43 C2.1 ; 240.42,106.43 240.42,104.41 U1.2 U1.2 ; 141.11,100.42 141.62,99.91 144.16,99.91 ; 143.4,116.93 v1(142.22,118.11) ; 143.4,116.93 143.4,116.96 U2.75 ; 144.16,99.91 144.16,99.59 U2.28 ; J5.3 8.46,108.64 8.46,113.28 13.28,118.11 J1.1 R1.2 20.77,116.84 34.29,116.84 J3.1 36.83,116.84 v1(46.2,116.84)
  Bottom Layer w0.254: v1(46.2,116.84) 47.47,118.11 v1(142.22,118.11)
+5V: length 38.2
  Top Layer w0.254: 247.3,107.78 246.79,107.27 244,107.27 241.21,110.06 241.21,112.05 ; 247.3,107.78 247.3,111.08 246.29,112.09 246.29,113.02 J4.A4 ; 247.3,107.78 247.68,107.78 C1.1 248.92,104.51 U1.3 ; C3.1 v1(231.65,112.9) 232.5,112.05 241.21,112.05 ; J4.B4 241.44,112.28 241.21,112.05
  Bottom Layer w0.254: J6.3 229.49,115.06 v1(231.65,112.9)
GND: length 1527.4
  Top Layer w0.254: SW4_2.2 55.69,12.1 55.69,31.12 ; SW1_12.2 SW1_11.2 SW1_10.2 SW1_9.2 SW1_8.2 168.66,70.23 168.66,85.85 167.51,87 167.51,88.27 ; 229.59,108.2 231.9,108.2 C7.2 234.92,107.95 C6.2 C5.2 240.42,107.98 C2.2 242.14,106.49 R4.2 246.25,106.49 ; 229.59,108.2 C4.2 ; 229.59,108.2 229.59,108.97 230.1,109.47 C3.2 230,112.12 230,113.54 ; 196.15,31.12 143.83,31.12 143.7,31.24 134.81,31.24 ; 196.15,31.12 196.15,12.13 SW4_4-8.2 SW4_4-8.2 199.48,12.94 214.39,12.94 SW4_4-8.4 SW4_4-8.4 SW4_4-8.6 234.69,12.44 245.85,12.44 ; 196.15,31.12 220.03,31.12 ; SW2_11.2 SW2_10.2 SW2_9.2 SW2_8.2 SW2_7.2 SW2_6.2 124.9,50.17 ; 167.51,88.27 SW0_8.2 158.12,88.77 150.24,96.65 148.97,96.65 148.72,96.39 v1(148.21,96.39) ; 167.51,88.27 SW0_9.2 SW0_10.2 SW0_11.2 SW0_12.2 SW0_13-14.2 ; 5.66,117.78 7.26,119.38 26.67,119.38 J2.2 29.21,119.38 44.45,119.38 J3.5 ; 5.66,117.78 5.66,108.89 J5.4 9.78,104.78 9.78,88.27 ; 5.66,117.78 5.66,117.97 5.53,118.11 ; 77.98,69.22 78.74,68.45 78.74,51.75 SW2_3.2 ; 77.98,69.22 SW1_4.2 SW1_5.2 111.12,69.85 111.12,87.76 v1(110.62,88.27) SW0_6.2 128.14,88.27 139.92,100.05 140.74,100.87 v1(140.74,101.06) ; 77.98,69.22 SW1_3.2 ; v1(35.43,88.27) SW0_1.2 11.3,88.27 ; 239.65,113.28 239.65,113.85 J4.S1 ; 239.65,113.28 239.14,113.28 238.89,113.54 230,113.54 ; 239.65,113.28 240.42,113.28 J4.B1 ; 230,113.54 230,113.79 226.95,116.84 J6.2 ; SW2_0.2 SW2_0.2 8.1,36.7 7.59,36.19 7.59,31.62 8.1,31.12 ; 268.48,88.27 SW0_13-14.2 SW0_13-14.2 ; 268.48,88.27 269.24,87.5 269.24,70.8 SW1_13.2 ; 268.48,88.27 272.42,88.27 ; 133.56,109.49 132.29,110.76 132.29,112.62 132.97,113.3 133.99,113.3 135.51,114.82 v1(137.03,114.82) ; 245.85,12.44 245.21,13.08 245.21,21.21 246.22,22.22 246.22,31.12 260.57,31.12 ; 245.85,12.44 SW4_4-8.8 247.38,13.23 271.25,13.23 SW4_4-8.10 ; 8.1,31.12 8.1,22.22 7.08,21.21 7.08,13.08 SW4_0.2 ; 8.1,31.12 31.56,31.12 ; 249.81,107 249.81,107.2 C1.2 248.92,111.18 J4.A1 247.25,113.06 J4.S1 J4.S1 ; 249.81,107 249.81,106.24 250.82,105.22 250.82,102.93 250.57,102.68 ; 249.81,107 250.63,107 SW1.C 264.85,109.22 SW1.S2 ; 55.69,31.12 124.78,31.12 124.9,31.24 ; 55.69,31.12 31.56,31.12 ; 246.25,106.49 R3.2 ; 246.25,106.49 246.25,104.97 248.54,102.68 250.57,102.68 ; SW2_3.2 SW2_4.2 SW2_5.2 124.9,50.17 ; SW2_3.2 SW2_2.2 ; 124.9,31.24 124.9,31.37 125.41,31.88 125.41,49.66 124.9,50.17 ; 124.9,31.24 134.81,31.24 ; 134.81,31.24 134.9,31.16 134.9,7.1 SW4_3.2 ; U2.27 143.61,99.44 143.38,99.44 v1(143.13,99.19) ; 31.56,31.12 30.73,30.29 30.73,13.24 SW4_1.2 ; 11.3,88.27 9.78,88.27 ; 11.3,88.27 12.32,87.25 12.32,71.06 SW1_0.2 ; 9.78,88.27 5.71,88.27 ; 260.57,31.12 272.41,31.12 ; 260.57,31.12 260.57,50.1 SW2_12.2 ; 250.57,102.68 250.7,102.68 250.82,102.55 250.82,100.59 U1.1 249.53,92.1 SW0_13-14.2 ; U2.49 152.95,105.65 v1(153.03,105.65) ; U2.74 145.16,118.01 145.16,118.12 144.65,118.63 144.15,118.63 v1(143.38,117.87)
  Bottom Layer w0.254: v1(153.03,105.65) 151.37,107.31 150.24,107.31 146.69,103.76 ; 146.69,103.76 146.69,105.68 139.83,112.54 ; 146.69,103.76 142.88,99.95 142.88,99.44 ; 139.83,112.54 143.38,116.09 v1(143.38,117.87) ; 139.83,112.54 137.54,114.82 v1(137.03,114.82) ; 53.47,88.27 53.98,87.76 53.98,69.85 SW1_2.2 39.88,69.22 ; 53.47,88.27 SW0_2.2 v1(35.43,88.27) ; 53.47,88.27 SW0_3.2 SW0_5.2 v1(110.62,88.27) ; SW1_7.2 149.22,69.85 149.22,95.38 v1(148.21,96.39) 146.94,96.39 144.91,98.42 143.89,98.42 ; 143.89,98.42 139.06,93.6 SW0_7.2 139.06,78.74 SW1_6.2 ; 143.89,98.42 v1(143.13,99.19) 142.88,99.44 ; 39.88,69.22 SW1_1.2 ; 39.88,69.22 40.89,68.2 40.89,52.01 SW2_1.2 ; 142.88,99.44 141.25,101.06 v1(140.74,101.06) ; J6.2 228.22,119.38 238.3,119.38 J4.S1
BOOT: length 135.3
  Top Layer w0.254: U2.94 134.56,112.02 133.55,112.02 v1(133.04,112.53) ; v1(10.16,118.11) R2.2 ; v1(30.68,108.46) 23.31,108.46 v1(20.52,111.26) ; v1(105.61,109.48) 105.35,109.22 82.75,109.22 v1(81.99,109.99) ; v1(108.66,112.53) v1(107.39,111.26)
  Bottom Layer w0.254: v1(20.52,111.26) 20.52,111.76 15.44,116.84 12.7,116.84 J1.2 v1(10.16,118.11) ; v1(107.39,111.26) v1(105.61,109.48) ; v1(81.99,109.99) 32.2,109.99 v1(30.68,108.46) ; v1(133.04,112.53) v1(108.66,112.53)
D_N: length 103.7
  Top Layer w0.254: v1(222.28,116.87) 146.84,116.87 U2.70 ; 243.62,112.04 244.38,112.04 244.63,112.3 244.63,113.02 J4.B7 ; 243.62,112.04 243.62,111.79 243.36,111.53 243.11,111.53 v1(242.85,111.79) ; 243.62,112.04 243.62,113.04 J4.A7
  Bottom Layer w0.254: v1(242.85,111.79) 227.36,111.79 v1(222.28,116.87)
D_P: length 104
  Top Layer w0.254: U2.71 148.52,119.25 235.9,119.25 239.96,115.19 241.74,115.19 243.01,113.92 243.09,113.92 ; 243.09,113.92 243.34,114.17 243.85,114.17 244.09,113.94 J4.A6 ; 243.09,113.92 J4.B6
ENC_A: length 110
  Top Layer w0.254: U2.66 146.48,113.68 v1(146.23,113.68)
  Bottom Layer w0.254: v1(146.23,113.68) 146.99,114.44 222.93,114.44 226.41,110.96 252.09,110.96 SW1.A
ENC_B: length 109.9
  Top Layer w0.254: v1(228.93,108.95) 222.33,115.55 147.65,115.55 U2.67
  Bottom Layer w0.254: v1(228.93,108.95) 250.62,108.95 SW1.B
ENC_SW: length 127.9
  Top Layer w0.254: v1(224.56,105.96) 225.06,105.45 239.29,105.45 v1(239.54,105.7) ; 147.59,114.08 146.83,113.32 v1(146.83,113.07)
  Bottom Layer w0.254: v1(224.56,105.96) 223.79,106.72 214.4,106.72 207.79,113.32 150.9,113.32 149.12,111.54 147.59,111.54 146.83,112.31 v1(146.83,113.07) ; v1(239.54,105.7) 240.05,105.19 265.82,105.19 SW1.S1
I2C_CLK: length 129.5
  Top Layer w0.254: 136.03,111.96 135.31,112.68 v1(135.02,112.68) ; J5.2 10.49,109.14 17.35,109.14 20.14,111.94 70.43,111.94 72.24,113.74 129.9,113.74 v1(130.15,114)
  Bottom Layer w0.254: v1(135.02,112.68) 134.37,113.33 130.81,113.33 v1(130.15,114)
I2C_DAT: length 133.1
  Top Layer w0.254: v1(104.14,109.83) 104.4,110.09 130.81,110.09 v1(131.07,109.83) ; U2.93 136.4,110.89 v1(136.4,110.59)
  Bottom Layer w0.254: v1(104.14,109.83) 100.59,113.39 32.77,113.39 28.52,109.14 13.03,109.14 J5.1 ; v1(136.4,110.59) 131.83,110.59 v1(131.07,109.83)
K0_0: length 138.1
  Top Layer w0.254: v1(134.49,115.44) 36.7,115.44 v1(33.91,112.65) ; v1(138.05,116.2) 138.16,116.2 U2.83
  Bottom Layer w0.254: SW0_0.1 v1(33.91,112.65) ; v1(134.49,115.44) 137.29,115.44 v1(138.05,116.2)
K0_1: length 135
  Top Layer w0.254: SW0_1.1 31.37,91.06 v1(31.37,111.12) ; v1(139.57,113.66) 139.28,113.66 U2.85 ; v1(138.3,116.97) 137.79,116.97 137.03,116.2 36.45,116.2 v1(32.89,112.65)
  Bottom Layer w0.254: v1(31.37,111.12) v1(32.89,112.65) ; v1(139.57,113.66) 139.57,115.7 v1(138.3,116.97)
K0_2: length 118
  Top Layer w0.254: v1(137.6,109.72) 137.86,109.98 137.86,112.26 U2.89 ; v1(140.2,114.29) 140.2,110.42 v1(137.15,107.38) ; v1(106.67,113.02) 72.38,113.02 SW0_2.1
  Bottom Layer w0.254: v1(137.6,109.72) 137.6,107.83 v1(137.15,107.38) ; v1(140.2,114.29) 140.2,116.07 138.68,117.6 132.07,117.6 127.76,113.28 106.93,113.28 v1(106.67,113.02)
K0_3: length 76.5
  Top Layer w0.254: U2.97 135.28,109.18 v1(135.28,108.92)
  Bottom Layer w0.254: SW0_3.1 82.54,90.81 83.97,89.37 88.8,89.37 108.36,108.92 v1(135.28,108.92)
K0_4: length 53.2
  Top Layer w0.254: U2.4 119.53,90.97 v1(109.37,90.97) ; v1(91.17,90.81) SW0_4.1
  Bottom Layer w0.254: v1(109.37,90.97) 108.1,92.24 92.61,92.24 v1(91.17,90.81)
K0_5: length 36
  Top Layer w0.254: SW0_5.1 108.08,90.04 109.36,90.04 109.87,90.55 119.78,90.55 121.65,92.42 128.76,92.42 U2.15
K0_6: length 17.2
  Top Layer w0.254: SW0_6.1 129.97,90.81 U2.19
K0_7: length 9
  Top Layer w0.254: SW0_7.1 141.69,94.53 U2.25
K0_8: length 21.6
  Top Layer w0.254: SW0_8.1 157.9,90.81 U2.35
K0_9: length 40.9
  Top Layer w0.254: v1(157.9,94.59) 157.65,94.59 149.01,103.23 ; SW0_9.1 176.75,90.81 175.21,89.26 v1(166.03,89.26)
  Bottom Layer w0.254: v1(157.9,94.59) 163.23,89.26 v1(166.03,89.26)
K0_10: length 57.7
  Top Layer w0.254: U2.45 162.97,92.81 183.54,92.81 185.54,90.81 SW0_10.1
K0_11: length 79.7
  Top Layer w0.254: U2.53 151.09,109.09 v1(150.82,109.09) ; v1(157.1,106.05) 206.38,106.05 221.62,90.81
  Bottom Layer w0.254: v1(157.1,106.05) 154.05,109.09 v1(150.82,109.09)
K0_12: length 99.4
  Top Layer w0.254: U2.57 151.19,112.02 190.3,112.02 194.87,107.45 v1(224.08,107.45)
  Bottom Layer w0.254: SW0_12.1 224.08,107.39 v1(224.08,107.45)
K0_13: length 130.9
  Top Layer w0.254: 148.3,113.38 149.06,114.14 217.39,114.14 v1(217.9,113.63)
  Bottom Layer w0.254: SW0_13-14.1 SW0_13-14.1 245.8,90.81 222.98,113.63 v1(217.9,113.63)
K0_14: length 143.2
  Top Layer w0.254: v1(228.21,107.38) 220.85,114.75 148.96,114.75 U2.64
  Bottom Layer w0.254: SW0_13-14.3 271.33,90.81 269.87,89.35 268.6,89.35 267.58,90.36 261.23,90.36 260.22,89.35 259.2,89.35 258.18,90.36 245.23,90.36 v1(228.21,107.38)
K1_0: length 141.4
  Top Layer w0.254: U2.84 138.09,115.55 135.56,115.55 134.68,114.68 128.08,114.68 v1(127.83,114.43) ; SW1_0.1 24.96,71.75 42.99,89.79 48.32,89.79 48.83,89.28 56.45,89.28 79.57,112.4 104.97,112.4 v1(105.22,112.14)
  Bottom Layer w0.254: v1(127.83,114.43) 127.57,114.17 106.74,114.17 105.22,112.65 v1(105.22,112.14)
K1_1: length 114.7
  Top Layer w0.254: SW1_1.1 80.26,111.38 105.92,111.38 107.7,113.16 132.08,113.16 132.84,113.92 v1(133.35,113.92) ; v1(135.64,114.1) 136.72,114.1 137.45,113.38
  Bottom Layer w0.254: v1(135.64,114.1) 135.45,113.92 v1(133.35,113.92)
K1_2: length 91.6
  Top Layer w0.254: v1(89.41,92.26) 80.2,92.26 SW1_2.1 ; v1(133.1,111.31) 133.86,111.31 U2.96
  Bottom Layer w0.254: v1(89.41,92.26) 108.46,111.31 v1(133.1,111.31)
K1_3: length 69.4
  Top Layer w0.254: SW1_3.1 80.31,71.75 100.89,92.34 120.2,92.34 U2.3
K1_4: length 54.8
  Top Layer w0.254: v1(124.46,91.82) 122.68,90.04 111.51,90.04 107.82,86.36 107.82,81.79 SW1_4.1 ; v1(125.73,93.09) 126.75,93.09 136.14,102.49 136.14,102.63 U2.11
  Bottom Layer w0.254: v1(124.46,91.82) v1(125.73,93.09)
K1_5: length 40.8
  Top Layer w0.254: U2.18 139.95,101.49 v1(139.95,101.73) ; SW1_5.1 132.84,87.76 v1(132.84,89.03)
  Bottom Layer w0.254: v1(132.84,89.03) 139.95,96.14 v1(139.95,101.73)
K1_6: length 29.1
  Top Layer w0.254: SW1_6.1 135.89,93.19 141.34,98.63
K1_7: length 32.4
  Top Layer w0.254: U2.32 146.94,99.64 146.94,98.17 146.79,98.02 146.79,79.9 SW1_7.1
K1_8: length 42.1
  Top Layer w0.254: 147.59,101.82 156.99,92.42 v1(157.25,92.42)
  Bottom Layer w0.254: SW1_8.1 174.01,71.78 174.01,76.92 161.82,89.12 161.82,89.37 158.77,92.42 v1(157.25,92.42)
K1_9: length 57.9
  Top Layer w0.254: v1(168.15,87.5) 183.9,71.75 SW1_9.1 ; U2.41 152.74,100.2 v1(153.16,100.2)
  Bottom Layer w0.254: v1(168.15,87.5) 164.34,87.5 157.99,93.85 157.73,93.85 153.16,98.42 v1(153.16,100.2)
K1_10: length 74.9
  Top Layer w0.254: v1(190.5,91.82) 177.8,104.52 151.96,104.52 U2.46
  Bottom Layer w0.254: SW1_10.1 210.57,71.75 v1(190.5,91.82)
K1_11: length 96.1
  Top Layer w0.254: v1(194.06,107.31) 155.96,107.31 152.4,110.87 152.16,110.87 U2.54
  Bottom Layer w0.254: v1(194.06,107.31) 229.62,71.75 SW1_11.1
K1_12: length 117.5
  Top Layer w0.254: v1(151.13,112.65) 151.11,112.65 U2.58
  Bottom Layer w0.254: SW1_12.1 248.64,71.75 208.26,112.14 151.64,112.14 v1(151.13,112.65)
K1_13: length 145.5
  Top Layer w0.254: U2.62 147.89,112.26 v1(147.76,112.26)
  Bottom Layer w0.254: v1(147.76,112.26) 149.29,113.79 207.96,113.79 208.72,113.02 221.56,113.02 244.79,89.79 246.32,89.79 264.35,71.75 SW1_13.1
K2_0: length 152.1
  Top Layer w0.254: v1(131.99,109.85) 131.22,110.62 81.69,110.62 41.31,70.23 38.26,70.23 20.73,52.7 SW2_0.1 ; v1(138.92,111.9) 138.92,113.32 U2.86
  Bottom Layer w0.254: SW2_0.1 SW2_0.1 ; v1(138.92,111.9) 136.87,109.85 v1(131.99,109.85)
K2_1: length 116.5
  Top Layer w0.254: 134.97,110.9 135.99,109.89 135.99,108.62 v1(134.97,107.6)
  Bottom Layer w0.254: SW2_1.1 50.87,52.7 71.47,73.31 100.68,73.31 v1(134.97,107.6)
K2_2: length 97.6
  Top Layer w0.254: SW2_2.1 64.45,63.37 74.38,73.3 80.22,73.3 99.87,92.95 120.1,92.95 133.56,106.41
K2_3: length 75.7
  Top Layer w0.254: U2.10 135.8,103 135.06,103 v1(134.56,103.5)
  Bottom Layer w0.254: SW2_3.1 84.71,52.7 117.54,85.53 117.54,87.76 133.29,103.5 v1(134.56,103.5)
K2_4: length 63.4
  Top Layer w0.254: U2.17 137.86,100.11 v1(137.86,99.95)
  Bottom Layer w0.254: v1(137.86,99.95) 137.86,96.39 111.95,70.48 111.95,62.1 SW2_4.1
K2_5: length 54.3
  Top Layer w0.254: U2.23 134.13,92.13 134.13,87.56 121.6,75.03 SW2_5.1
K2_6: length 47.1
  Top Layer w0.254: v1(142.28,94.98) 144.06,96.76 U2.26
  Bottom Layer w0.254: SW2_6.1 140.5,52.85 140.5,93.2 v1(142.28,94.98)
K2_7: length 53.5
  Top Layer w0.254: SW2_7.1 159.7,69.81 152.12,77.39 152.12,91.61 147.55,96.18 147.55,99.74 U2.33
K2_8: length 62.5
  Top Layer w0.254: U2.37 148.9,101.22 v1(149.03,101.22)
  Bottom Layer w0.254: SW2_8.1 178.5,52.7 151.83,79.38 151.83,98.42 v1(149.03,101.22)
K2_9: length 82.8
  Top Layer w0.254: v1(152.59,93.34) 152.59,82.17 182.05,52.7 SW2_9.1 ; 149.72,103.94 148.95,104.7 v1(148.78,104.7)
  Bottom Layer w0.254: v1(148.78,104.7) 152.34,101.14 152.34,93.6 v1(152.59,93.34)
K2_10: length 92.2
  Top Layer w0.254: v1(150.72,106.72) 150.72,106.47 U2.47 ; v1(204.74,52.7) SW2_10.1
  Bottom Layer w0.254: v1(204.74,52.7) 201.18,52.7 188.14,65.75 188.14,69.81 187.3,70.65 186.79,70.65 v1(150.72,106.72)
K2_11: length 109.8
  Top Layer w0.254: U2.55 151.89,111.31 177.29,111.31 v1(177.8,110.8)
  Bottom Layer w0.254: SW2_11.1 235.64,52.7 222.25,66.1 222.25,66.86 178.31,110.8 v1(177.8,110.8)
K2_12: length 144.1
  Top Layer w0.254: v1(149.26,110.62) 149.13,110.74 149.13,111.38 149.72,111.96
  Bottom Layer w0.254: v1(149.26,110.62) 150.27,111.63 196.5,111.63 223.68,84.45 233.13,84.45 264.88,52.7 SW2_12.1
K3_0: length 159.9
  Top Layer w0.254: v1(135.52,106.87) 135.77,106.87 138.31,109.41 138.31,112.71 138.44,112.84 138.44,113.1 U2.87
  Bottom Layer w0.254: v1(135.52,106.87) 97.67,69.03 94.22,69.03 76.95,51.75 76.59,51.75 62.36,37.53 27.85,37.53 23.97,33.66 14.45,33.66
K3_1: length 147.3
  Top Layer w0.254: v1(122.16,87.68) 119.88,85.39 119.88,76.76 111.75,68.63 111.75,68.37 111.2,67.83 108.66,67.83 91.68,50.85 v1(79.49,50.85) ; U2.91 137.4,111.3 137.4,110.54 136.64,109.78 v1(136.64,109.27)
  Bottom Layer w0.254: v1(79.49,50.85) 79.49,50.34 77.94,48.79 75.4,48.79 61.71,35.1 37.32,35.1 35.88,33.66 ; v1(122.16,87.68) 122.67,88.19 125.72,88.19 136.13,98.6 136.13,108.76 v1(136.64,109.27)
K3_2: length 120.8
  Top Layer w0.254: SW3_2.1 55.14,33.87 55.14,54.7 74.19,73.75 77.2,73.75 110.22,106.77 U2.1
K3_3: length 107.6
  Top Layer w0.254: v1(136.85,104.9) 136.34,105.41 136.09,105.41 U2.7
  Bottom Layer w0.254: v1(136.85,104.9) 136.85,101.85 138.62,100.08 138.62,96.52 130.24,88.13 130.24,79.24 104.07,53.08 104.07,52.07 102.04,50.03 98.99,50.03 82.74,33.78 74.1,33.78 SW3_3.1
K3_4: length 89.3
  Top Layer w0.254: U2.16 139.27,102.22 v1(139.27,102.48) ; v1(130.89,81.65) 122.51,73.27 v1(122.51,63.11)
  Bottom Layer w0.254: v1(122.51,63.11) 122.48,63.11 SW3_4.1 ; v1(139.27,102.48) 139.27,96.38 130.89,88 v1(130.89,81.65)
K3_5: length 77.5
  Top Layer w0.254: v1(112.18,50.83) 112.18,61.24 118.28,67.34 118.28,72.42 133.52,87.66 133.52,92.23 U2.22
  Bottom Layer w0.254: SW3_5.1 112.18,33.76 v1(112.18,50.83)
K3_6: length 73.4
  Top Layer w0.254: v1(144.84,92.33) 144.84,97.41 145.86,98.42 145.86,98.6 U2.29
  Bottom Layer w0.254: v1(144.84,92.33) 143.83,91.31 143.83,90.04 145.35,88.52 145.35,47.88 SW3_6.1
K3_7: length 70.7
  Top Layer w0.254: U2.31 145.06,100.81 v1(144.81,100.81)
  Bottom Layer w0.254: v1(144.81,100.81) 150.04,95.58 150.04,33.79 SW3_7.1
K3_8: length 76.7
  Top Layer w0.254: v1(148.15,98.42) 148.15,99.85 U2.34
  Bottom Layer w0.254: v1(148.15,98.42) 150.69,95.89 150.69,71.75 169.23,53.21 SW3_8.1
K3_9: length 87.7
  Top Layer w0.254: v1(147.54,103.35) 147.54,103.28 148.3,102.52
  Bottom Layer w0.254: SW3_9.1 178.63,43.31 178.63,50.17 151.19,77.6 151.19,96.39 147.54,100.05 v1(147.54,103.35)
K3_10: length 95.1
  Top Layer w0.254: v1(158.71,91.59) 158.71,95.65 U2.43
  Bottom Layer w0.254: v1(158.71,91.59) 159.54,90.75 159.54,81.86 189.95,51.46 189.95,49.68 205.97,33.66 SW3_10.1
K3_11: length 106
  Top Layer w0.254: v1(153.99,105.28) 153.75,105.04 152.7,105.04 152.45,105.3 152.45,105.45 U2.48
  Bottom Layer w0.254: SW3_11.1 224.85,33.66 192.85,65.66 192.85,67.69 176.09,84.45 174.82,84.45 v1(153.99,105.28)
K3_12: length 145
  Top Layer w0.254: U2.56 149.96,110.08 v1(149.96,109.95)
  Bottom Layer w0.254: v1(149.96,109.95) 168.91,109.95 208.63,70.23 214.12,70.23 238,46.36 239.87,46.36 SW3_12-13.1 SW3_12-13.1
K3_13: length 166
  Top Layer w0.254: v1(192.4,110.87) 189.94,113.33 150.38,113.33 U2.60
  Bottom Layer w0.254: SW3_12-13.3 269.37,33.66 232.79,70.23 227.71,70.23 192.4,105.54 v1(192.4,110.87)
K4_0: length 168.3
  Top Layer w0.254: v1(133.95,112.67) 134.71,113.43 135.98,113.43 U2.90 ; v1(27.01,31.74) 31.54,36.27 31.54,36.33 32.61,37.4 32.67,37.4 32.85,37.59 36.16,37.59 63.59,65.02 63.59,66.92 v1(86.75,90.08)
  Bottom Layer w0.254: 14.45,14.6 23.77,23.92 23.77,28.5 v1(27.01,31.74) ; v1(133.95,112.67) 133.95,112.42 133.44,111.91 107.18,111.91 86.75,91.48 v1(86.75,90.08)
K4_1: length 142.2
  Top Layer w0.254: v1(134.27,108.33) 134.53,108.59 134.53,109.23 U2.98 ; v1(110.39,84.45) 110.39,75.06 v1(105.31,69.98)
  Bottom Layer w0.254: v1(110.39,84.45) v1(134.27,108.33) ; 38.26,14.6 41.81,14.6 73.56,46.36 76.36,46.36 81.19,51.18 86.52,51.18 v1(105.31,69.98)
K4_2: length 122.5
  Top Layer w0.254: v1(134.62,101.89) 133.86,102.65 133.86,104.59 U2.5
  Bottom Layer w0.254: 62.07,14.6 73.76,26.29 73.76,31.88 72.49,33.15 72.49,35.89 121.51,84.91 121.51,88.01 134.62,101.12 v1(134.62,101.89)
K4_3: length 104
  Top Layer w0.254: U2.30 146.46,98.71 146.46,98.42 145.96,97.92 v1(145.96,92.33)
  Bottom Layer w0.254: SW4_3.1 128.43,25.02 145.96,42.55 145.96,89.28 146.97,90.3 146.97,91.31 v1(145.96,92.33)
K4_4: length 113
  Top Layer w0.254: U2.39 156.53,95 v1(156.53,93.73)
  Bottom Layer w0.254: 204.95,14.6 202.56,14.6 202.49,14.69 202.49,32.28 158.82,75.95 158.82,85.6 156.53,87.89 v1(156.53,93.73)
K4_5: length 128
  Top Layer w0.254: U2.44 162.87,92.2 165.16,92.2 166.68,90.67 v1(166.68,89.91)
  Bottom Layer w0.254: v1(166.68,89.91) 185.22,71.37 185.22,68.58 187.51,66.29 187.51,65.78 221.54,31.75 221.54,29.54 221.53,29.53 221.53,27.62 221.54,27.61 221.54,14.68 221.62,14.6 228.76,14.6
K4_6: length 137
  Top Layer w0.254: 240.66,14.6 240.68,14.62 v1(240.68,24.81) ; U2.51 153.81,107.86 v1(153.81,107.36)
  Bottom Layer w0.254: v1(153.81,107.36) 171.34,89.83 180.23,89.83 203.09,66.97 203.09,64.43 218.58,48.94 219.85,48.94 240.68,28.11 v1(240.68,24.81)
K4_7: length 149.8
  Top Layer w0.254: v1(152.95,107.46) 152.57,107.46 151.56,108.47 151.56,108.85 U2.52
  Bottom Layer w0.254: 259.71,14.6 252.57,14.6 252.43,14.75 249.73,14.75 218.23,46.24 218.23,48.53 193.59,73.17 190.1,73.17 176.39,86.88 173.27,86.88 152.95,107.2 v1(152.95,107.46)
K4_8: length 174.3
  Top Layer w0.254: v1(151.04,108.1) 150.79,108.1 148.25,110.64 148.25,111.91 149.01,112.67
  Bottom Layer w0.254: 278.76,14.6 276.38,14.6 276.36,14.63 266.61,14.63 253.15,28.09 253.15,28.85 249.34,32.66 245.02,32.66 228,49.68 228,51.67 210.69,68.98 209.21,68.98 191.17,87.02 185.08,87.02 181.78,90.32 171.87,90.32 154.09,108.1 v1(151.04,108.1)
NET-(J4-PADA5): length 5.5
  Top Layer w0.254: R3.1 245.09,109.43 J4.A5
NET-(J4-PADB5): length 5.9
  Top Layer w0.254: R4.1 242.09,110.53 J4.B5
PA9: length 79.1
  Top Layer w0.254: U2.68 147.47,116.08 222.38,116.08 J6.1
RESET: length 134.6
  Top Layer w0.254: U2.14 138.82,103.19 138.82,103.24 v1(137.8,104.26) ; v1(24.13,118.11) R1.1 ; v1(122.94,116.84) v1(132.33,116.84)
  Bottom Layer w0.254: v1(132.33,116.84) 132.33,116.59 134.11,114.81 135.89,114.81 138.06,112.64 139.07,112.64 139.58,112.13 139.58,106.04 v1(137.8,104.26) ; v1(122.94,116.84) 121.8,115.71 45.58,115.71 J3.4 41.91,116.84 26.67,116.84 J2.1 v1(24.13,118.11)
SWCLK: length 105.9
  Top Layer w0.254: v1(141.48,118.87) 141.48,117.83 U2.76
  Bottom Layer w0.254: J3.2 39.88,119.89 140.46,119.89 v1(141.48,118.87)
SWDIO: length 109
  Top Layer w0.254: v1(46.99,118.62) 48.01,119.63 144.27,119.63 145.88,118.02 145.88,117.32 U2.72
  Bottom Layer w0.254: J3.3 41.91,119.38 46.23,119.38 v1(46.99,118.62)
